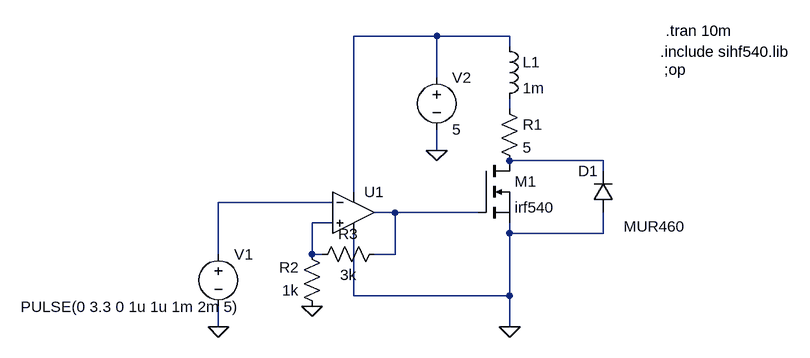
[diagram p0: schematic MOSFET gate driver OPAMP.asc]
MOSFET gate driver OPAMP.asc, the LTspice schematic file:
Version 4
SHEET 1 880 680
WIRE 80 -48 -48 -48
WIRE 192 -48 80 -48
WIRE 192 -32 192 -48
WIRE 80 16 80 -48
WIRE 192 64 192 48
WIRE 80 128 80 96
WIRE 336 144 192 144
WIRE 336 160 336 144
WIRE -48 192 -48 -48
WIRE -80 208 -256 208
WIRE 16 224 -16 224
WIRE 144 224 16 224
WIRE -80 240 -112 240
WIRE 192 256 192 240
WIRE 336 256 336 224
WIRE 336 256 192 256
WIRE -256 288 -256 208
WIRE -112 288 -112 240
WIRE -96 288 -112 288
WIRE 16 288 16 224
WIRE 16 288 -16 288
WIRE -48 352 -48 256
WIRE 192 352 192 256
WIRE 192 352 -48 352
WIRE -256 400 -256 368
WIRE 192 400 192 352
FLAG 192 400 0
FLAG 80 128 0
FLAG -256 400 0
FLAG -112 368 0
SYMBOL res 176 48 R0
SYMATTR InstName R1
SYMATTR Value 5
SYMBOL nmos 144 144 R0
SYMATTR InstName M1
SYMATTR Value irf540
SYMATTR Prefix X
SYMBOL voltage -256 272 R0
WINDOW 3 -304 97 Left 2
WINDOW 123 0 0 Left 0
WINDOW 39 0 0 Left 0
SYMATTR InstName V1
SYMATTR Value PULSE(0 3.3 0 1u 1u 1m 2m 5)
SYMBOL voltage 80 0 R0
WINDOW 123 0 0 Left 0
WINDOW 39 0 0 Left 0
SYMATTR InstName V2
SYMATTR Value 5
SYMBOL Opamps\\UniversalOpamp2 -48 224 R0
SYMATTR InstName U1
SYMBOL res -96 384 R180
WINDOW 0 36 76 Left 2
WINDOW 3 36 40 Left 2
SYMATTR InstName R2
SYMATTR Value 1k
SYMBOL res -112 304 R270
WINDOW 0 32 56 VTop 2
WINDOW 3 0 56 VBottom 2
SYMATTR InstName R3
SYMATTR Value 3k
SYMBOL diode 352 224 R180
WINDOW 0 24 64 Left 2
WINDOW 3 -111 -21 Left 2
SYMATTR InstName D1
SYMATTR Value MUR460
SYMBOL ind 176 -48 R0
SYMATTR InstName L1
SYMATTR Value 1m
TEXT 424 -24 Left 2 !.include sihf540.lib
TEXT 430 4 Left 2 !;op
TEXT 432 -56 Left 2 !.tran 10m

The netlist it stands for:
* MOSFET gate driver OPAMP.asc
R1 N002 N003 5
XM1 N003 N005 0 irf540  ; pins D G S
V1 N004 0 PULSE(0 3.3 0 1u 1u 1m 2m 5)
V2 N001 0 5
XU1 N006 N004 N001 0 N005 level.2 Avol=1Meg GBW=10Meg Slew=10Meg ilimit=25m rail=0 Vos=0 phimargin=45 en=0 enk=0 in=0 ink=0 Rin=500Meg  ; pins IN+ IN- V+ V- OUT
R2 0 N006 1k
R3 N006 N005 3k
D1 0 N003 MUR460
L1 N001 N002 1m
.model D D
.lib standard.dio
.include sihf540.lib
;op
.tran 10m
.lib UniversalOpamps2.sub
.backanno
.end